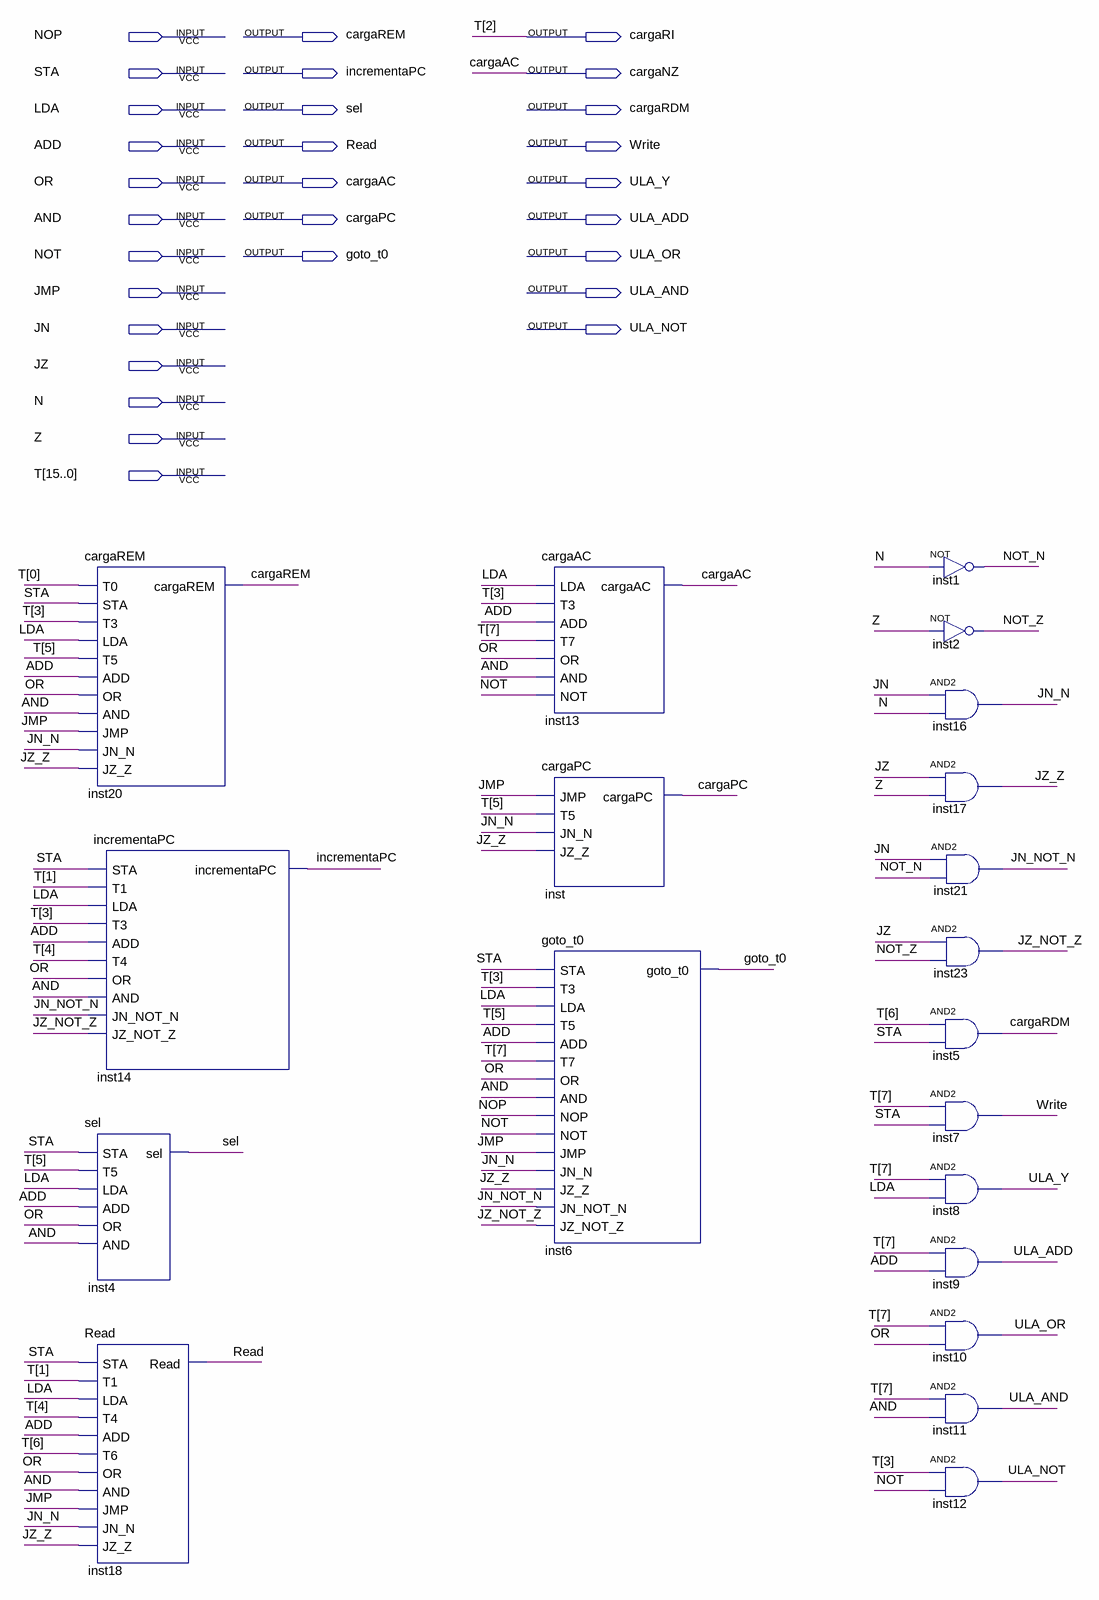
[diagram p0: schematic sheet]
// Quartus schematic CONTROL_UNIT.bdf as structural Verilog: 20 symbols, 29 pins
module CONTROL_UNIT (
  input  NOP,
  input  STA,
  input  LDA,
  input  ADD,
  input  OR,
  input  AND,
  input  NOT,
  input  JMP,
  input  JN,
  input  JZ,
  input  N,
  input  Z,
  input  [15:0] T,
  output cargaREM,
  output cargaRI,
  output incrementaPC,
  output cargaNZ,
  output sel,
  output cargaRDM,
  output Read,
  output Write,
  output cargaAC,
  output ULA_Y,
  output cargaPC,
  output ULA_ADD,
  output goto_t0,
  output ULA_OR,
  output ULA_AND,
  output ULA_NOT
);

  wire JN_N, JN_NOT_N, JZ_NOT_Z, JZ_Z, NOT_N, NOT_Z;

  cargaREM inst20 (
    .T0(T[0]), .STA(STA), .T3(T[3]), .LDA(LDA), .T5(T[5]), .ADD(ADD), .OR(OR), .AND(AND), .JMP(JMP),
    .JN_N(JN_N), .JZ_Z(JZ_Z), .cargaREM(cargaREM));
  incrementaPC inst14 (
    .STA(STA), .T1(T[1]), .LDA(LDA), .T3(T[3]), .ADD(ADD), .T4(T[4]), .OR(OR), .AND(AND),
    .JN_NOT_N(JN_NOT_N), .JZ_NOT_Z(JZ_NOT_Z), .incrementaPC(incrementaPC));
  sel inst4 (.STA(STA), .T5(T[5]), .LDA(LDA), .ADD(ADD), .OR(OR), .AND(AND), .sel(sel));
  Read inst18 (
    .STA(STA), .T1(T[1]), .LDA(LDA), .T4(T[4]), .ADD(ADD), .T6(T[6]), .OR(OR), .AND(AND), .JMP(JMP),
    .JN_N(JN_N), .JZ_Z(JZ_Z), .Read(Read));
  cargaAC inst13 (.LDA(LDA), .T3(T[3]), .ADD(ADD), .T7(T[7]), .OR(OR), .AND(AND), .NOT(NOT), .cargaAC(cargaAC));
  cargaPC inst (.JMP(JMP), .T5(T[5]), .JN_N(JN_N), .JZ_Z(JZ_Z), .cargaPC(cargaPC));
  goto_t0 inst6 (
    .STA(STA), .T3(T[3]), .LDA(LDA), .T5(T[5]), .ADD(ADD), .T7(T[7]), .OR(OR), .AND(AND), .NOP(NOP),
    .NOT(NOT), .JMP(JMP), .JN_N(JN_N), .JZ_Z(JZ_Z), .JN_NOT_N(JN_NOT_N), .JZ_NOT_Z(JZ_NOT_Z),
    .goto_t0(goto_t0));
  not inst1 (NOT_N, N);
  not inst2 (NOT_Z, Z);
  and inst16 (JN_N, JN, N);
  and inst17 (JZ_Z, JZ, Z);
  and inst21 (JN_NOT_N, JN, NOT_N);
  and inst23 (JZ_NOT_Z, JZ, NOT_Z);
  and inst5 (cargaRDM, T[6], STA);
  and inst7 (Write, T[7], STA);
  and inst8 (ULA_Y, T[7], LDA);
  and inst9 (ULA_ADD, T[7], ADD);
  and inst10 (ULA_OR, T[7], OR);
  and inst11 (ULA_AND, T[7], AND);
  and inst12 (ULA_NOT, T[3], NOT);

  assign cargaNZ = cargaAC;
  assign cargaRI = T[2];
endmodule
